# Altium schematic sheet MCU_Power_Supply_Sheet.SchDoc
size A4
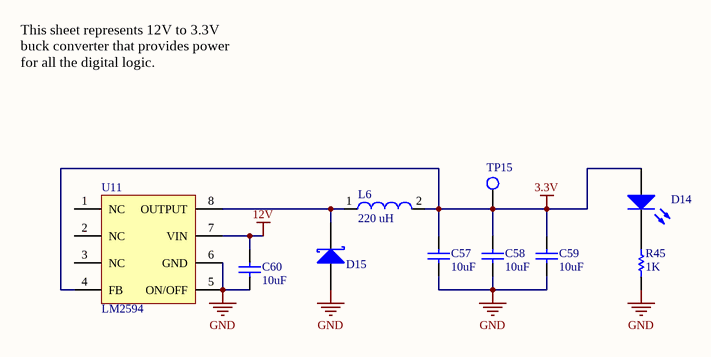
[diagram p0: MCU_Power_Supply_Sheet.SchDoc]

## Parts
C57  10uF  [C1206]
C58  10uF  [C1206]
C59  10uF  [C1206]
C60  10uF  [C1206]
D14  Green_LED_150060GS75000  [Green_LED_150060GS75000]  (value not drawn)
D15  NRVTS245  [SOD123]  (value not drawn)
L6  220 uH  [WE-TPC_1028]
R45  value 1K  [0603]  (hidden comment: R_0603_1k_75V_100mW)
TP15  Test Point  [Test_Point]  (value not drawn)
U11  LM2594  [D008_M]

## Nets
3.3V: C57.2 C58.2 C59.2 D14.2 L6.2 TP15.1(TP) U11.4(FB)
12V: C60.2 U11.7(VIN)
GND: C57.1 C58.1 C59.1 C60.1 D15.2 R45.1 U11.5(ON/OFF) U11.6(GND)
NetD14_1: D14.1 R45.2
NetD15_1: D15.1 L6.1 U11.8(OUTPUT)

Not connected (* = marked no-connect by the designer): U11 1(NC) 2(NC) 3(NC)

## Notes on the sheet
- This sheet represents 12V to 3.3V buck converter that provides power for all the digital logic.

## Library data of the parts
C57-C60 = C_1206_10uF_25V_CER: Capacitor; Manufacturer Part Number: 1206X106K250CT; Voltage Rating: 25V; Unit Cost: .07; Supplier 1: Farnell; Supplier Part Number 1: 2497152RL; ComponentLinkURL1: http://ie.farnell.com/walsin/1206x106k250ct/capacitor-mlcc-x5r-10uf-25v-1206/dp/2497152RL; Value: 10uF
D14 = Green_LED_150060GS75000: WURTH ELEKTRONIK  150060GS75000  LED, Green, SMD, 30 mA, 3.2 V, 520 nm; Unit Cost: 0.287; ComponentLinkURL1: http://ie.farnell.com/wurth-elektronik/150060gs75000/led-0603-green-430mcd-520nm/dp/2322070?ost=150060GS75000&selectedCategoryId=&categoryNameResp=All%2BCategories&searchView=table&iscrfnonsku=false; Manufacturer Part Number: 150060GS75000; Supplier 1: Farnell; Supplier Part Number 1: 2322070; Manufacturer: WURTH ELEKTRONIK
D15 = NRVTS245: ON SEMICONDUCTOR  NRVTS245ESFT1G  Schottky Rectifier, Single, 45 V, 2 A, SOD-123, 2 Pins, 650 mV; Unit Cost: 0.0894; Value: 650mV; ComponentLinkURL1: http://ie.farnell.com/on-semiconductor/nrvts245esft1g/diode-schottky-2a-45v-sod-123/dp/2473409?ost=2473409&selectedCategoryId=&categoryNameResp=All%2BCategories&searchView=table&iscrfnonsku=false; Manufacturer Part Number: NRVTS245ESFT1G; Supplier 1: Farnell; Supplier 2: *; Manufacturer: ON SEMICONDUCTOR; Supplier Part Number 1: 2473409
L6 = WE-TPC 1028, 744065221: WE-TPC SMD Shielded Tiny Power Inductor, Size 1028, 220 uH; Manufacturer: Wurth Elektronik; IR: 0.5 A; Isat: 0.55 A; Rdc typ.: 750 mOhm; Rdc max.: 1000 mOhm; Frequence: 4 MHz; Unit Cost: 1.71; ComponentLink1Description: Manufacturer; ComponentLink1URL: http://ie.farnell.com/wurth-elektronik/744065221/inductor-power-220uh-30-10-3x10/dp/2211511; Created by: Baojun Chen; Created Date: April 2016; ComponentLink2Description: Datasheet; ComponentLink2URL: http://katalog.we-online.com/pbs/datasheet/744065221.pdf; L: 220 uH; PartNo.: 744065221; Supplier 1: Farnell; Manufacturer Part Number: 744065221; Supplier Part Number 1: 2211511
R45 = R_0603_1k_75V_100mW: Resistor; Manufacturer Part Number: ERJ3GEYJ102V; Manufacturer: PANASONIC ELECTRONIC COMPONENTS; Voltage Rating: 75V; Unit Cost: 0.0123; Supplier 1: Farnell; Supplier 2: Digikey; Supplier Part Number 1: 2059601; Supplier Part Number 2: *; ComponentLinkURL1: http://ie.farnell.com/panasonic-electronic-components/erj3geyj102v/res-thick-film-1k-5-0-1w-0603/dp/2059601
TP15 = Test_Point: HARWIN  S1751-46R  PCB Test Point, S1751 Series, Surface Mount, Copper Alloy, Tin Plated Contacts; Unit Cost: 0.129; ComponentLnkURL1: http://ie.farnell.com/harwin/s1751-46r/test-point-pcb-smt/dp/2293786?ost=2293786&selectedCategoryId=&categoryNameResp=All%2BCategories&searchView=table&iscrfnonsku=false; Manufacturer: HARWIN; Manufacturer Part Number: S1751-46R; Supplier 1: Farnell; Supplier Part Number 1: 2293786; Value: *
U11 = LM2594: TEXAS INSTRUMENTS  LM2594M-3.3  Buck (Step Down) Switching Regulator, Fixed, 4.5V-40V In, 3.3V And 0.5A Out, SOIC-8; Unit Cost: 2.52; ComponentLinkURL1: http://ie.farnell.com/texas-instruments/lm2594m-3-3/switching-reg-0-5a-3-3v-smd-2594/dp/1215200; Manufacturer Part Number: LM2594M-3.3; Supplier 1: Farnell; Supplier 2: *; Manufacturer: TEXAS INSTRUMENTS; Value: 3.3V; Supplier Part Number 1: 1215200